# Altium schematic sheet Team12.SchDoc: Measurments' Project
size C; DrawnBy: Asmaa Sameh - Mena Emiel- Reem Saleh; Revision: Hesham Khaleh; ProjectName: Microprocessor Design
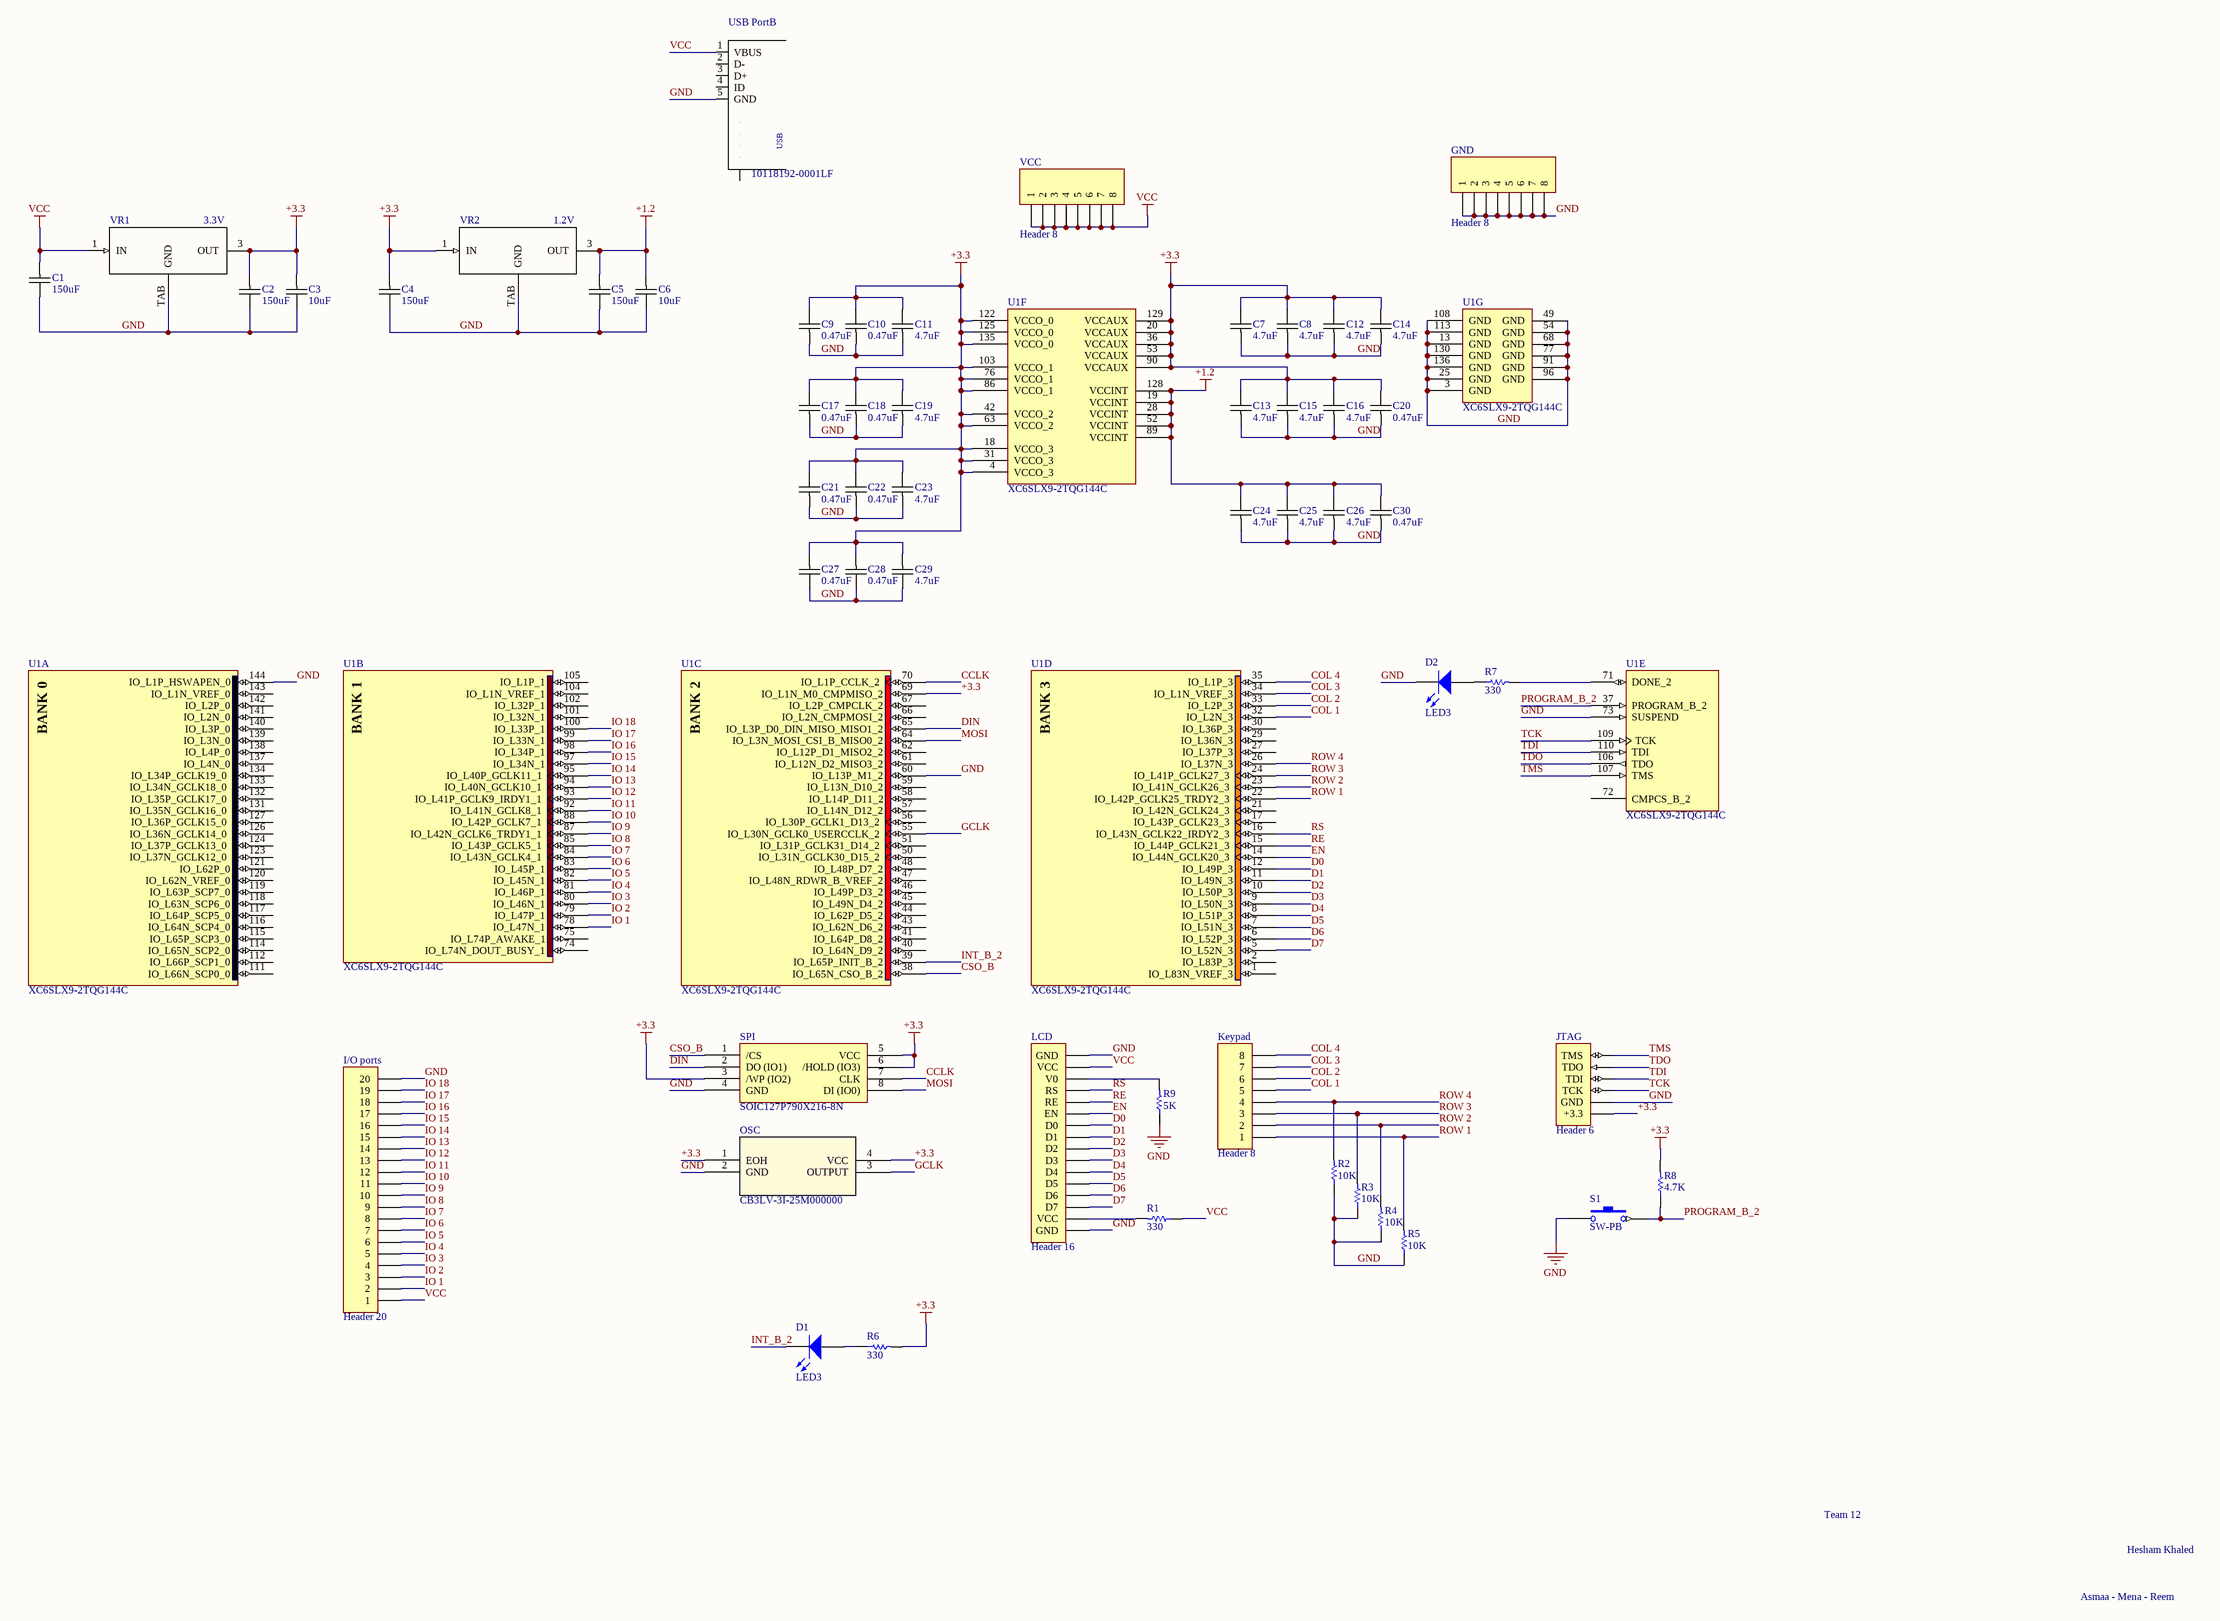
[diagram p0: Team12.SchDoc]

## Parts
C1  150uF  [0805C-TBD]
C2  150uF  [0805C-TBD]
C3  10uF  [0805C-TBD]
C4  150uF  [0805C-TBD]
C5  150uF  [0805C-TBD]
C6  10uF  [0805C-TBD]
C7  4.7uF  [0805C-TBD]
C8  4.7uF  [0805C-TBD]
C9  0.47uF  [0805C-TBD]
C10  0.47uF  [0805C-TBD]
C11  4.7uF  [0805C-TBD]
C12  4.7uF  [0805C-TBD]
C13  4.7uF  [0805C-TBD]
C14  4.7uF  [0805C-TBD]
C15  4.7uF  [0805C-TBD]
C16  4.7uF  [0805C-TBD]
C17  0.47uF  [0805C-TBD]
C18  0.47uF  [0805C-TBD]
C19  4.7uF  [0805C-TBD]
C20  0.47uF  [0805C-TBD]
C21  0.47uF  [0805C-TBD]
C22  0.47uF  [0805C-TBD]
C23  4.7uF  [0805C-TBD]
C24  4.7uF  [0805C-TBD]
C25  4.7uF  [0805C-TBD]
C26  4.7uF  [0805C-TBD]
C27  0.47uF  [0805C-TBD]
C28  0.47uF  [0805C-TBD]
C29  4.7uF  [0805C-TBD]
C30  0.47uF  [0805C-TBD]
D1  LED3  [DSO-C2/D5.6]
D2  LED3  [DSO-C2/D5.6]
GND  Header 8  [HDR1X8]
I/O_ports  Header 20  [HDR1X20]
JTAG  Header 6  [HDR1X6]
Keypad  Header 8  [HDR1X8]
LCD  Header 16  [HDR1X16]
OSC  CB3LV-3I-25M000000  [CRYS_CB3LV-3I-01]
R1  330  [ERA-0805]
R2  10K  [ERA-0805]
R3  10K  [ERA-0805]
R4  10K  [ERA-0805]
R5  10K  [ERA-0805]
R6  330  [ERA-0805]
R7  330  [ERA-0805]
R8  4.7K  [ERA-0805]
R9  5K  [ERA-0805]
S1  SW-PB  [SPST-2]
SPI  SOIC127P790X216-8N  [*SOIC127P790X216-8N]
U1  XC6SLX9-2TQG144C  [TQG144_N]  (parts A,B,C,D,E,F,G of 7)
USB_PortB  10118192-0001LF  [10118192-0001LF_10118192-0001LF(Primary)]
VCC  Header 8  [HDR1X8]
VR1  3.3V  [*D2PAK_MC7805ACD2TG(Primary)]
VR2  1.2V  [*D2PAK_MC7805ACD2TG(Primary)]

## Nets
+1.2: C5.1 C6.1 C24.2 C25.2 C26.2 C30.2 U1.19(VCCINT) U1.28(VCCINT) U1.52(VCCINT) U1.89(VCCINT) U1.128(VCCINT) VR2.3(OUT)
+3.3: C2.1 C3.1 C4.1 C7.2 C8.2 C9.2 C10.2 C11.2 C12.2 C13.2 C14.2 C15.2 C16.2 C17.2 C18.2 C19.2 C20.2 C21.2 C22.2 C23.2 C27.1 C28.1 C29.1 JTAG.1(+3.3) OSC.1(EOH) OSC.4(VCC) R6.2 R8.2 SPI.3(/WP_(IO2)) SPI.5(VCC) SPI.6(/HOLD_(IO3)) U1.4(VCCO_3) U1.18(VCCO_3) U1.20(VCCAUX) U1.31(VCCO_3) U1.36(VCCAUX) U1.42(VCCO_2) U1.53(VCCAUX) U1.63(VCCO_2) U1.69(IO_L1N_M0_CMPMISO_2) U1.76(VCCO_1) U1.86(VCCO_1) U1.90(VCCAUX) U1.103(VCCO_1) U1.122(VCCO_0) U1.125(VCCO_0) U1.129(VCCAUX) U1.135(VCCO_0) VR1.3(OUT) VR2.1(IN)
GND: C1.2 C2.2 C3.2 C4.2 C5.2 C6.2 C7.1 C8.1 C9.1 C10.1 C11.1 C12.1 C13.1 C14.1 C15.1 C16.1 C17.1 C18.1 C19.1 C20.1 C21.1 C22.1 C23.1 C24.1 C25.1 C26.1 C27.2 C28.2 C29.2 C30.1 D2.2(K) GND.1 GND.2 GND.3 GND.4 GND.5 GND.6 GND.7 GND.8 I/O_ports.20 JTAG.2(GND) LCD.1(GND) LCD.16(GND) OSC.2(GND) R2.1 R3.1 R4.1 R5.1 R9.1 S1.1(GND) SPI.4(GND) U1.3(GND) U1.13(GND) U1.25(GND) U1.49(GND) U1.54(GND) U1.60(IO_L13P_M1_2) U1.68(GND) U1.73(SUSPEND) U1.77(GND) U1.91(GND) U1.96(GND) U1.108(GND) U1.113(GND) U1.130(GND) U1.136(GND) U1.144(IO_L1P_HSWAPEN_0) USB_PortB.5(GND) VR1.TAB(GND) VR2.TAB(GND)
VCC: C1.1 I/O_ports.1 LCD.15(VCC) R1.1 USB_PortB.1(VBUS) VCC.1 VCC.2 VCC.3 VCC.4 VCC.5 VCC.6 VCC.7 VCC.8 VR1.1(IN)
CCLK: SPI.7(CLK) U1.70(IO_L1P_CCLK_2)
COL 1: Keypad.5 U1.32(IO_L2N_3)
COL 2: Keypad.6 U1.33(IO_L2P_3)
COL 3: Keypad.7 U1.34(IO_L1N_VREF_3)
COL 4: Keypad.8 U1.35(IO_L1P_3)
CSO_B: SPI.1(/CS) U1.38(IO_L65N_CSO_B_2)
D0: LCD.10(D0) U1.12(IO_L49P_3)
D1: LCD.9(D1) U1.11(IO_L49N_3)
D2: LCD.8(D2) U1.10(IO_L50P_3)
D3: LCD.7(D3) U1.9(IO_L50N_3)
D4: LCD.6(D4) U1.8(IO_L51P_3)
D5: LCD.5(D5) U1.7(IO_L51N_3)
D6: LCD.4(D6) U1.6(IO_L52P_3)
D7: LCD.3(D7) U1.5(IO_L52N_3)
DIN: SPI.2(DO_(IO1)) U1.65(IO_L3P_D0_DIN_MISO_MISO1_2)
EN: LCD.11(EN) U1.14(IO_L44N_GCLK20_3)
GCLK: OSC.3(OUTPUT) U1.55(IO_L30N_GCLK0_USERCCLK_2)
INT_B_2: D1.2(K) U1.39(IO_L65P_INIT_B_2)
IO 1: I/O_ports.2 U1.78(IO_L47N_1)
IO 2: I/O_ports.3 U1.79(IO_L47P_1)
IO 3: I/O_ports.4 U1.80(IO_L46N_1)
IO 4: I/O_ports.5 U1.81(IO_L46P_1)
IO 5: I/O_ports.6 U1.82(IO_L45N_1)
IO 6: I/O_ports.7 U1.83(IO_L45P_1)
IO 7: I/O_ports.8 U1.84(IO_L43N_GCLK4_1)
IO 8: I/O_ports.9 U1.85(IO_L43P_GCLK5_1)
IO 9: I/O_ports.10 U1.87(IO_L42N_GCLK6_TRDY1_1)
IO 10: I/O_ports.11 U1.88(IO_L42P_GCLK7_1)
IO 11: I/O_ports.12 U1.92(IO_L41N_GCLK8_1)
IO 12: I/O_ports.13 U1.93(IO_L41P_GCLK9_IRDY1_1)
IO 13: I/O_ports.14 U1.94(IO_L40N_GCLK10_1)
IO 14: I/O_ports.15 U1.95(IO_L40P_GCLK11_1)
IO 15: I/O_ports.16 U1.97(IO_L34N_1)
IO 16: I/O_ports.17 U1.98(IO_L34P_1)
IO 17: I/O_ports.18 U1.99(IO_L33N_1)
IO 18: I/O_ports.19 U1.100(IO_L33P_1)
MOSI: SPI.8(DI_(IO0)) U1.64(IO_L3N_MOSI_CSI_B_MISO0_2)
PROGRAM_B_2: R8.1 S1.2 U1.37(PROGRAM_B_2)
RE: LCD.12(RE) U1.15(IO_L44P_GCLK21_3)
ROW 1: Keypad.1 R5.2 U1.22(IO_L42P_GCLK25_TRDY2_3)
ROW 2: Keypad.2 R4.2 U1.23(IO_L41N_GCLK26_3)
ROW 3: Keypad.3 R3.2 U1.24(IO_L41P_GCLK27_3)
ROW 4: Keypad.4 R2.2 U1.26(IO_L37N_3)
RS: LCD.13(RS) U1.16(IO_L43N_GCLK22_IRDY2_3)
TCK: JTAG.3(TCK) U1.109(TCK)
TDI: JTAG.4(TDI) U1.110(TDI)
TDO: JTAG.5(TDO) U1.106(TDO)
TMS: JTAG.6(TMS) U1.107(TMS)
NetD1_1: D1.1(A) R6.1
NetD2_1: D2.1(A) R7.1
NetLCD_2: LCD.2(VCC) R1.2
NetLCD_14: LCD.14(V0) R9.2
NetR7_2: R7.2 U1.71(DONE_2)

Not connected (* = marked no-connect by the designer): U1 1(IO_L83N_VREF_3) 2(IO_L83P_3) 17(IO_L43P_GCLK23_3) 21(IO_L42N_GCLK24_3) 27(IO_L37P_3) 29(IO_L36N_3) 30(IO_L36P_3) 40(IO_L64N_D9_2) 41(IO_L64P_D8_2) 43(IO_L62N_D6_2) 44(IO_L62P_D5_2) 45(IO_L49N_D4_2) 46(IO_L49P_D3_2) 47(IO_L48N_RDWR_B_VREF_2) 48(IO_L48P_D7_2) 50(IO_L31N_GCLK30_D15_2) 51(IO_L31P_GCLK31_D14_2) 56(IO_L30P_GCLK1_D13_2) 57(IO_L14N_D12_2) 58(IO_L14P_D11_2) 59(IO_L13N_D10_2) 61(IO_L12N_D2_MISO3_2) 62(IO_L12P_D1_MISO2_2) 66(IO_L2N_CMPMOSI_2) 67(IO_L2P_CMPCLK_2) 72(CMPCS_B_2) 74(IO_L74N_DOUT_BUSY_1) 75(IO_L74P_AWAKE_1) 101(IO_L32N_1) 102(IO_L32P_1) 104(IO_L1N_VREF_1) 105(IO_L1P_1) 111(IO_L66N_SCP0_0) 112(IO_L66P_SCP1_0) 114(IO_L65N_SCP2_0) 115(IO_L65P_SCP3_0) 116(IO_L64N_SCP4_0) 117(IO_L64P_SCP5_0) 118(IO_L63N_SCP6_0) 119(IO_L63P_SCP7_0) 120(IO_L62N_VREF_0) 121(IO_L62P_0) 123(IO_L37N_GCLK12_0) 124(IO_L37P_GCLK13_0) 126(IO_L36N_GCLK14_0) 127(IO_L36P_GCLK15_0) 131(IO_L35N_GCLK16_0) 132(IO_L35P_GCLK17_0) 133(IO_L34N_GCLK18_0) 134(IO_L34P_GCLK19_0) 137(IO_L4N_0) 138(IO_L4P_0) 139(IO_L3N_0) 140(IO_L3P_0) 141(IO_L2N_0) 142(IO_L2P_0) 143(IO_L1N_VREF_0); USB_PortB 2(D-) 3(D+) 4(ID) M1(S) M2(S) S1(S) S2(S) S3(S) S4(S)

## Notes on the sheet
- Team 12
- Asmaa - Mena - Reem
- Hesham Khaled
- (in symbol 10118192-0001LF) USB
- (in symbol XC6SLX9-2TQG144C, part A) BANK 0
- (in symbol XC6SLX9-2TQG144C, part B) BANK 1
- (in symbol XC6SLX9-2TQG144C, part C) BANK 2
- (in symbol XC6SLX9-2TQG144C, part D) BANK 3

## Library data of the parts
C1-C30 = 0805C-27PF-50V-C0G-JOH: CAPACITOR 0805 CERAMIC; Supplier 1: Digi-Key; Supplier 2: Digi-Key; Supplier Part Number 2: 251R15S270FV4E-ND
D1 D2 = LED3: Typical BLUE SiC LED; Published: 8-Jun-2000; LatestRevisionDate: 17-Dec-2003; LatestRevisionNote: PCB Footprint replaced.; DatasheetVersion: 16-Apr-2002; PackageVersion: 16-Apr-2002; PackageReference: 3.5X2.8X1.9; Publisher: Altium Limited
GND Keypad VCC = Header 8: Header, 8-Pin; LatestRevisionDate: 17-Jul-2002; LatestRevisionNote: Re-released for DXP Platform.; Publisher: Altium Limited
I/O_ports = Header 20: Header, 20-Pin; LatestRevisionDate: 17-Jul-2002; LatestRevisionNote: Re-released for DXP Platform.; Publisher: Altium Limited
JTAG = Header 6: Header, 6-Pin; LatestRevisionDate: 17-Jul-2002; LatestRevisionNote: Re-released for DXP Platform.; Publisher: Altium Limited
LCD = Header 16: Header, 16-Pin; LatestRevisionDate: 17-Jul-2002; LatestRevisionNote: Re-released for DXP Platform.; Publisher: Altium Limited
OSC = CB3LV-3I-25M000000: No Description Available; Manufacturer_Part_Number: CB3LV-3I-14M7456; Vendor: CTS Components; Built_By: EMA_Kyle; SourceLibrary: CTS_Components_2020-2-18; Copyright: Copyright (C) 2018 Accelerated Designs. All rights reserved; RefDes: RefDes; Type: DEV; Value: Value
R1-R9 = ERA6Y: Rectangular Thick Film Chip Resistor, 10 Ohm to 1M Ohm Range, 0.1% and 0.5% Tolerance, 0805 Size, 0.1 W; Note: If flow soldering, adjust pad width of PCB Footprint to 0.7 - 0.8 times the width of the resistor.; Published: 17-Dec-2003; LatestRevisionDate: 19-Mar-2004; LatestRevisionNote: Silkscreen size reduced.; PackageDocument: Mar-2003; PackageReference: ERA-0805; Publisher: Altium Limited; Code_IPC: 2012 [0805]; ComponentLink1Description: Manufacturer Link; ComponentLink1URL: http://www.panasonic.com/industrial/components/resistive_products.htm; ComponentLink2Description: Datasheet; ComponentLink2URL: http://www.panasonic.com/industrial/components/pdf/AOA0000CE8.pdf
S1 = SW-PB: Switch; Published: 24-Mar-1999; LatestRevisionDate: 17-Jul-2002; LatestRevisionNote: Re-released for DXP Platform.; PackageReference: SPST-2; Publisher: Altium Limited
SPI = SOIC127P790X216-8N: IC FLASH 8M SPI 104MHZ 8SOIC
U1 = XC6SLX9-2TQG144C: Spartan-6 LX 1.2V FPGA, 102 User I/Os, 144-Pin TQFP (0.5mm Pitch), Speed Grade 2, Commercial Grade, Pb-Free; Published: 17-Nov-2009; DatasheetVersion: ver1.6, Nov-2010; PackageVersion: ver1.2, Jun-2004; PackageReference: TQG144; Publisher: Altium Limited; PackageDescription: 144-Pin Thin Quad Flat Pack (TQG144) - Pb-Free; Supplier 1: Digi-Key; Supplier Part Number 1: XC6SLX9-2TQG144C-ND; Code_JEDEC: MS-026-BFB; ComponentLink1Description: Manufacturer Link; ComponentLink1URL: http://www.xilinx.com; ComponentLink2Description: Spartan-6 Datasheet; ComponentLink2URL: http://www.xilinx.com/support/documentation/data_sheets/ds160.pdf; ComponentLink3Description: Spartan-6 Documents; ComponentLink3URL: http://www.xilinx.com/support/documentation/spartan-6.htm; ComponentLink4Description: Xilinx.com Home; ComponentLink4URL: http://www.xilinx.com
USB_PortB = 10118192-0001LF: Conn Micro USB Type B RCP 5 POS 0.65mm Solder RA SMD 5 Terminal 1 Port T/R; MF: Amphenol; Price: 0.23 USD; MP: 10118192-0001LF; Availability: Good; SnapEDA_Link: https://www.snapeda.com/parts/10118192-0001LF/Amphenol%20Solar/view-part/?ref=snap; Package: None; Value: *
VR1 VR2 = MC7805ACD2TG: Linear Voltage Regulator IC Positive Fixed 1 Output 1A D2PAK; MF: ON Semiconductor; Availability: Unavailable; Package: D2PAK ON Semiconductor; MP: MC7805ACD2TG; Price: None; SnapEDA_Link: https://www.snapeda.com/parts/MC7805ACD2TG/ON%20Semiconductor/view-part/104394/?ref=snap; Value: *